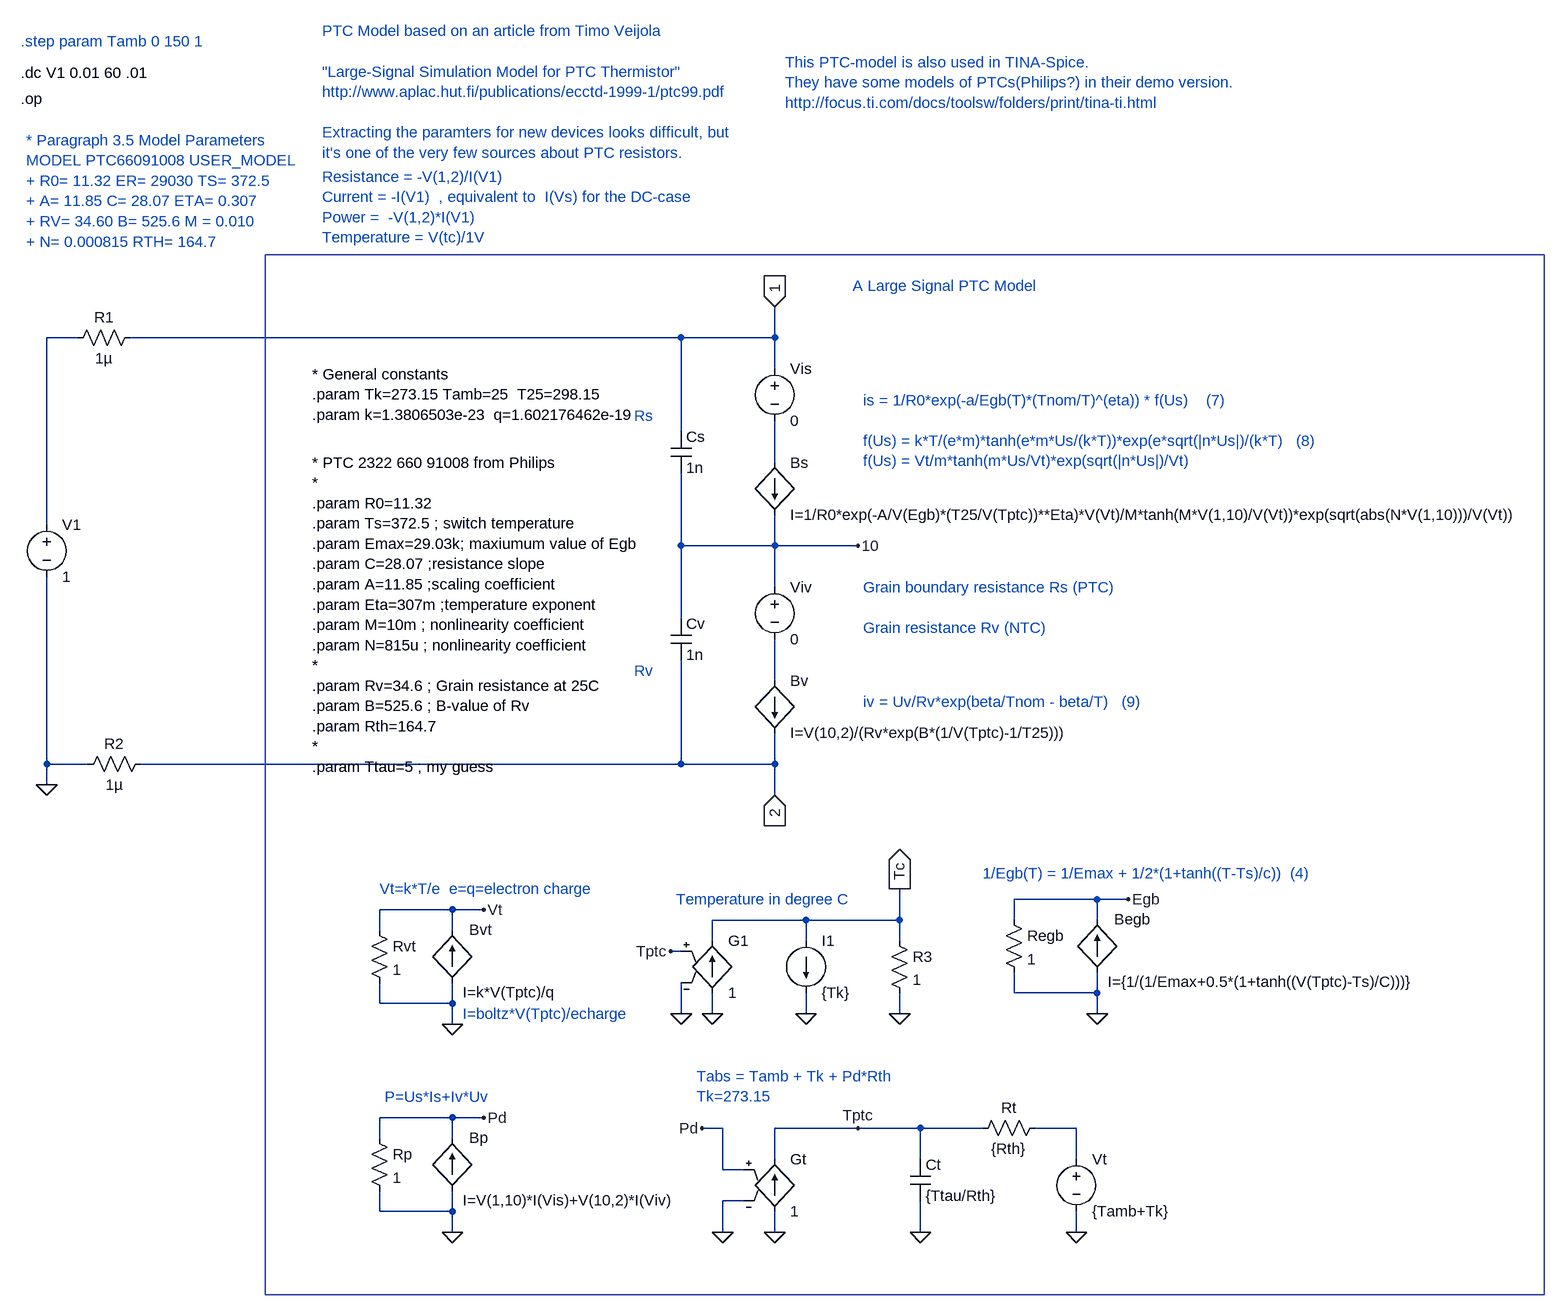
[diagram p0: schematic ptc_veijola1.asc]
ptc_veijola1.asc, the LTspice schematic file:
Version 4
SHEET 1 2388 1472
WIRE -512 240 -512 -48
WIRE -512 608 -512 320
WIRE -512 640 -512 608
WIRE -464 -48 -512 -48
WIRE -448 608 -512 608
WIRE 0 864 0 832
WIRE 0 976 0 944
WIRE 0 1184 0 1152
WIRE 0 1296 0 1264
WIRE 112 832 0 832
WIRE 112 864 112 832
WIRE 112 976 0 976
WIRE 112 976 112 944
WIRE 112 1008 112 976
WIRE 112 1152 0 1152
WIRE 112 1184 112 1152
WIRE 112 1296 0 1296
WIRE 112 1296 112 1264
WIRE 112 1328 112 1296
WIRE 160 832 112 832
WIRE 160 1152 112 1152
WIRE 464 -48 -384 -48
WIRE 464 96 464 -48
WIRE 464 272 464 160
WIRE 464 384 464 272
WIRE 464 608 -368 608
WIRE 464 608 464 448
WIRE 464 896 448 896
WIRE 464 992 464 944
WIRE 512 880 512 848
WIRE 512 992 512 960
WIRE 528 1168 496 1168
WIRE 528 1232 528 1168
WIRE 528 1328 528 1280
WIRE 560 1232 528 1232
WIRE 560 1280 528 1280
WIRE 608 -48 464 -48
WIRE 608 -48 608 -96
WIRE 608 0 608 -48
WIRE 608 144 608 80
WIRE 608 272 464 272
WIRE 608 272 608 224
WIRE 608 336 608 272
WIRE 608 480 608 416
WIRE 608 608 464 608
WIRE 608 608 608 560
WIRE 608 656 608 608
WIRE 608 1216 608 1168
WIRE 608 1328 608 1296
WIRE 656 848 512 848
WIRE 656 880 656 848
WIRE 656 992 656 960
WIRE 736 272 608 272
WIRE 736 1168 608 1168
WIRE 800 848 656 848
WIRE 800 848 800 800
WIRE 800 880 800 848
WIRE 800 992 800 960
WIRE 832 1168 736 1168
WIRE 832 1216 832 1168
WIRE 832 1328 832 1280
WIRE 928 1168 832 1168
WIRE 976 848 976 816
WIRE 976 960 976 928
WIRE 1072 1168 1008 1168
WIRE 1072 1216 1072 1168
WIRE 1072 1328 1072 1296
WIRE 1104 816 976 816
WIRE 1104 848 1104 816
WIRE 1104 960 976 960
WIRE 1104 960 1104 928
WIRE 1104 992 1104 960
WIRE 1152 816 1104 816
FLAG -512 640 0
FLAG 608 1328 0
FLAG 736 1168 Tptc
FLAG 112 1008 0
FLAG 160 832 Vt
FLAG 608 -96 1
IOPIN 608 -96 In
FLAG 608 656 2
IOPIN 608 656 In
FLAG 736 272 10
FLAG 1104 992 0
FLAG 1152 816 Egb
FLAG 112 1328 0
FLAG 160 1152 Pd
FLAG 1072 1328 0
FLAG 528 1328 0
FLAG 496 1168 Pd
FLAG 832 1328 0
FLAG 800 992 0
FLAG 512 992 0
FLAG 464 992 0
FLAG 448 896 Tptc
FLAG 656 992 0
FLAG 800 800 Tc
IOPIN 800 800 Out
SYMBOL voltage -512 224 R0
SYMATTR InstName V1
SYMATTR Value 1
SYMBOL bi 608 144 R0
SYMATTR InstName Bs
SYMATTR Value I=1/R0*exp(-A/V(Egb)*(T25/V(Tptc))**Eta)*V(Vt)/M*tanh(M*V(1,10)/V(Vt))*exp(sqrt(abs(N*V(1,10)))/V(Vt))
SYMBOL bi 608 480 R0
SYMATTR InstName Bv
SYMATTR Value I=V(10,2)/(Rv*exp(B*(1/V(Tptc)-1/T25)))
SYMBOL res -480 -32 R270
WINDOW 0 32 56 VTop 0
WINDOW 3 0 56 VBottom 0
SYMATTR InstName R1
SYMATTR Value 1µ
SYMBOL res -464 624 R270
WINDOW 0 32 56 VTop 0
WINDOW 3 0 56 VBottom 0
SYMATTR InstName R2
SYMATTR Value 1µ
SYMBOL res -16 848 R0
SYMATTR InstName Rvt
SYMATTR Value 1
SYMBOL bi 112 944 R180
WINDOW 0 -26 81 Right 0
WINDOW 3 -16 -15 Right 0
SYMATTR InstName Bvt
SYMATTR Value I=k*V(Tptc)/q
SYMBOL cap 448 96 R0
SYMATTR InstName Cs
SYMATTR Value 1n
SYMBOL cap 448 384 R0
SYMATTR InstName Cv
SYMATTR Value 1n
SYMBOL voltage 608 -16 R0
SYMATTR InstName Vis
SYMATTR Value 0
SYMBOL voltage 608 320 R0
SYMATTR InstName Viv
SYMATTR Value 0
SYMBOL res 960 832 R0
SYMATTR InstName Regb
SYMATTR Value 1
SYMBOL bi 1104 928 R180
WINDOW 0 -26 81 Right 0
WINDOW 3 -16 -15 Right 0
SYMATTR InstName Begb
SYMATTR Value I={1/(1/Emax+0.5*(1+tanh((V(Tptc)-Ts)/C)))}
SYMBOL res -16 1168 R0
SYMATTR InstName Rp
SYMATTR Value 1
SYMBOL bi 112 1264 R180
WINDOW 0 -26 81 Right 0
WINDOW 3 -16 -15 Right 0
SYMATTR InstName Bp
SYMATTR Value I=V(1,10)*I(Vis)+V(10,2)*I(Viv)
SYMBOL res 912 1184 R270
WINDOW 0 32 56 VTop 0
WINDOW 3 0 56 VBottom 0
SYMATTR InstName Rt
SYMATTR Value {Rth}
SYMBOL voltage 1072 1200 R0
SYMATTR InstName Vt
SYMATTR Value {Tamb+Tk}
SYMBOL g 608 1200 R0
SYMATTR InstName Gt
SYMATTR Value 1
SYMBOL cap 816 1216 R0
SYMATTR InstName Ct
SYMATTR Value {Ttau/Rth}
SYMBOL g 512 864 R0
SYMATTR InstName G1
SYMATTR Value 1
SYMBOL res 784 864 R0
SYMATTR InstName R3
SYMATTR Value 1
SYMBOL current 656 880 R0
SYMATTR InstName I1
SYMATTR Value {Tk}
TEXT 392 72 Left 0 ;Rs
TEXT 392 464 Left 0 ;Rv
TEXT -552 -416 Left 0 !.op
TEXT 0 800 Left 0 ;Vt=k*T/e  e=q=electron charge
TEXT -552 -456 Left 0 !.dc V1 0.01 60 .01
TEXT -552 -504 Left 0 ;.step param Tamb 0 150 1
TEXT 928 776 Left 0 ;1/Egb(T) = 1/Emax + 1/2*(1+tanh((T-Ts)/c))  (4)
TEXT 744 512 Left 0 ;iv = Uv/Rv*exp(beta/Tnom - beta/T)   (9)
TEXT 744 48 Left 0 ;is = 1/R0*exp(-a/Egb(T)*(Tnom/T)^(eta)) * f(Us)    (7)\n \nf(Us) = k*T/(e*m)*tanh(e*m*Us/(k*T))*exp(e*sqrt(|n*Us|)/(k*T)   (8)\nf(Us) = Vt/m*tanh(m*Us/Vt)*exp(sqrt(|n*Us|)/Vt)
TEXT 488 1088 Left 0 ;Tabs = Tamb + Tk + Pd*Rth\nTk=273.15
TEXT 8 1120 Left 0 ;P=Us*Is+Iv*Uv
TEXT -104 8 Left 0 !* General constants\n.param Tk=273.15 Tamb=25  T25=298.15\n.param k=1.3806503e-23  q=1.602176462e-19
TEXT 128 992 Left 0 ;I=boltz*V(Tptc)/echarge
TEXT -544 -352 Left 0 ;* Paragraph 3.5 Model Parameters\nMODEL PTC66091008 USER_MODEL\n+ R0= 11.32 ER= 29030 TS= 372.5\n+ A= 11.85 C= 28.07 ETA= 0.307\n+ RV= 34.60 B= 525.6 M = 0.010\n+ N= 0.000815 RTH= 164.7
TEXT -104 144 Left 0 !* PTC 2322 660 91008 from Philips\n* \n.param R0=11.32\n.param Ts=372.5 ; switch temperature\n.param Emax=29.03k; maxiumum value of Egb\n.param C=28.07 ;resistance slope\n.param A=11.85 ;scaling coefficient\n.param Eta=307m ;temperature exponent\n.param M=10m ; nonlinearity coefficient\n.param N=815u ; nonlinearity coefficient\n*\n.param Rv=34.6 ; Grain resistance at 25C\n.param B=525.6 ; B-value of Rv\n.param Rth=164.7 \n*\n.param Ttau=5 ; my guess
TEXT 456 816 Left 0 ;Temperature in degree C
TEXT 744 336 Left 0 ;Grain boundary resistance Rs (PTC)\n \nGrain resistance Rv (NTC)
TEXT -88 -520 Left 0 ;PTC Model based on an article from Timo Veijola\n \n"Large-Signal Simulation Model for PTC Thermistor"\nhttp://www.aplac.hut.fi/publications/ecctd-1999-1/ptc99.pdf\n \nExtracting the paramters for new devices looks difficult, but\nit's one of the very few sources about PTC resistors.
TEXT 624 -472 Left 0 ;This PTC-model is also used in TINA-Spice. \nThey have some models of PTCs(Philips?) in their demo version.\nhttp://focus.ti.com/docs/toolsw/folders/print/tina-ti.html
TEXT 728 -128 Left 0 ;A Large Signal PTC Model
TEXT -88 -296 Left 0 ;Resistance = -V(1,2)/I(V1)\nCurrent = -I(V1)  , equivalent to  I(Vs) for the DC-case\nPower =  -V(1,2)*I(V1)\nTemperature = V(tc)/1V
LINE Normal -176 736 -176 -176
LINE Normal -176 736 -176 736
LINE Normal -176 1424 -176 736
LINE Normal 1792 1424 -176 1424
LINE Normal 1792 -176 1792 1424
LINE Normal -176 -176 1792 -176

The netlist it stands for:
* ptc_veijola1.asc
V1 N001 0 1
Bs N002 10 I=1/R0*exp(-A/V(Egb)*(T25/V(Tptc))**Eta)*V(Vt)/M*tanh(M*V(1,10)/V(Vt))*exp(sqrt(abs(N*V(1,10)))/V(Vt))
Bv N003 2 I=V(10,2)/(Rv*exp(B*(1/V(Tptc)-1/T25)))
R1 N001 1 1µ
R2 0 2 1µ
Rvt Vt 0 1
Bvt 0 Vt I=k*V(Tptc)/q
Cs 1 10 1n
Cv 10 2 1n
Vis 1 N002 0
Viv 10 N003 0
Regb Egb 0 1
Begb 0 Egb I={1/(1/Emax+0.5*(1+tanh((V(Tptc)-Ts)/C)))}
Rp Pd 0 1
Bp 0 Pd I=V(1,10)*I(Vis)+V(10,2)*I(Viv)
Rt Tptc N004 {Rth}
Vt N004 0 {Tamb+Tk}
Gt 0 Tptc Pd 0 1
Ct Tptc 0 {Ttau/Rth}
G1 0 Tc Tptc 0 1
R3 Tc 0 1
I1 Tc 0 {Tk}
* Rs
* Rv
.op
* Vt=k*T/e  e=q=electron charge
.dc V1 0.01 60 .01
* .step param Tamb 0 150 1
* 1/Egb(T) = 1/Emax + 1/2*(1+tanh((T-Ts)/c))  (4)
* iv = Uv/Rv*exp(beta/Tnom - beta/T)   (9)
* is = 1/R0*exp(-a/Egb(T)*(Tnom/T)^(eta)) * f(Us)    (7)
* f(Us) = k*T/(e*m)*tanh(e*m*Us/(k*T))*exp(e*sqrt(|n*Us|)/(k*T)   (8)
* f(Us) = Vt/m*tanh(m*Us/Vt)*exp(sqrt(|n*Us|)/Vt)
* Tabs = Tamb + Tk + Pd*Rth
* Tk=273.15
* P=Us*Is+Iv*Uv
* General constants
.param Tk=273.15 Tamb=25  T25=298.15
.param k=1.3806503e-23  q=1.602176462e-19
* I=boltz*V(Tptc)/echarge
* * Paragraph 3.5 Model Parameters
* MODEL PTC66091008 USER_MODEL
* + R0= 11.32 ER= 29030 TS= 372.5
* + A= 11.85 C= 28.07 ETA= 0.307
* + RV= 34.60 B= 525.6 M = 0.010
* + N= 0.000815 RTH= 164.7
* PTC 2322 660 91008 from Philips
*
.param R0=11.32
.param Ts=372.5 ; switch temperature
.param Emax=29.03k; maxiumum value of Egb
.param C=28.07 ;resistance slope
.param A=11.85 ;scaling coefficient
.param Eta=307m ;temperature exponent
.param M=10m ; nonlinearity coefficient
.param N=815u ; nonlinearity coefficient
*
.param Rv=34.6 ; Grain resistance at 25C
.param B=525.6 ; B-value of Rv
.param Rth=164.7
*
.param Ttau=5 ; my guess
* Temperature in degree C
* Grain boundary resistance Rs (PTC)
* Grain resistance Rv (NTC)
* PTC Model based on an article from Timo Veijola
* "Large-Signal Simulation Model for PTC Thermistor"
* http://www.aplac.hut.fi/publications/ecctd-1999-1/ptc99.pdf
* Extracting the paramters for new devices looks difficult, but
* it's one of the very few sources about PTC resistors.
* This PTC-model is also used in TINA-Spice.
* They have some models of PTCs(Philips?) in their demo version.
* http://focus.ti.com/docs/toolsw/folders/print/tina-ti.html
* A Large Signal PTC Model
* Resistance = -V(1,2)/I(V1)
* Current = -I(V1)  , equivalent to  I(Vs) for the DC-case
* Power =  -V(1,2)*I(V1)
* Temperature = V(tc)/1V
.backanno
.end